# Altium schematic sheet MC_Sch_1.SchDoc
size A4
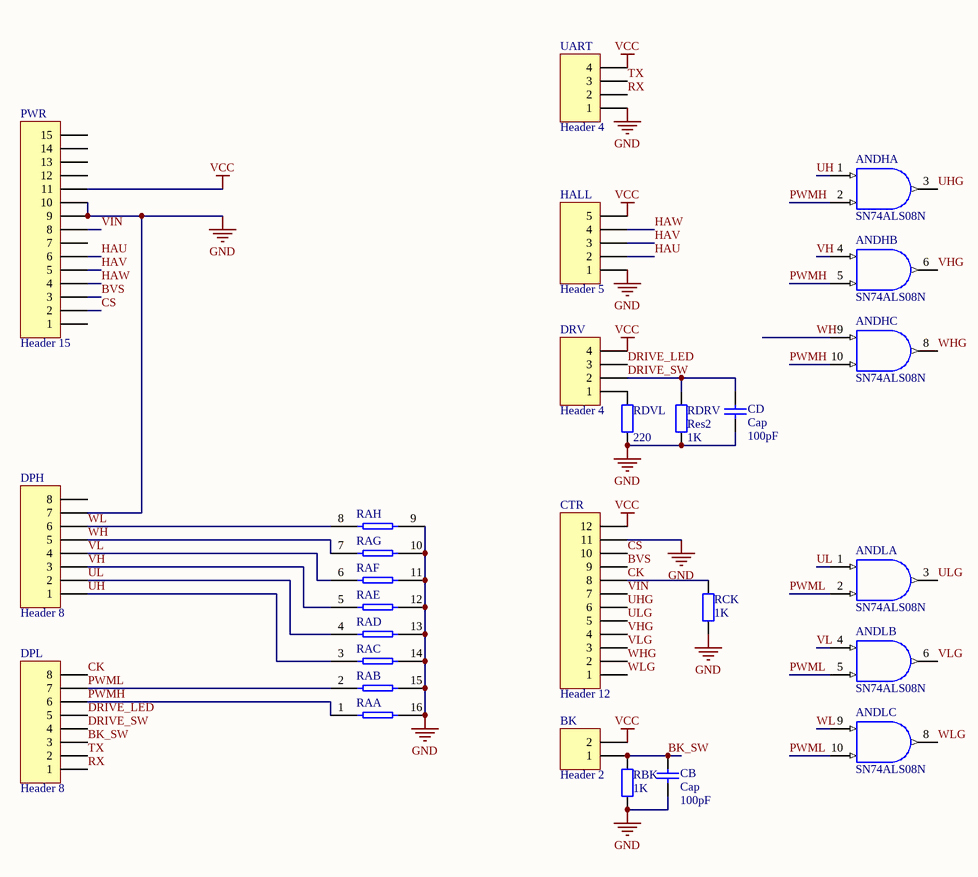
[diagram p0: MC_Sch_1.SchDoc]

## Parts
ANDH  SN74ALS08N  [N014]  (parts A,B,C of 4)
ANDL  SN74ALS08N  [N014]  (parts A,B,C of 4)
BK  Header 2  [HDR1X2]
CB  Cap  value 100pF  [CBB 6.3*6.3*5]
CD  Cap  value 100pF  [CBB 6.3*6.3*5]
CTR  Header 12  [HDR1X12]
DPH  Header 8  [HDR1X8]
DPL  Header 8  [HDR1X8]
DRV  Header 4  [HDR1X4]
HALL  Header 5  [HDR1X5]
PWR  Header 15  [HDR1X15]
RA  Res Pack2  [DIP-16]  (value not drawn)  (parts A,B,C,D,E,F,G,H of 8)
RBK  value 1K  [AXIAL-0.4]  (hidden comment: Res2)
RCK  value 1K  [AXIAL-0.4]  (hidden comment: Res2)
RDRV  Res2  value 1K  [AXIAL-0.4]
RDVL  value 220  [AXIAL-0.4]  (hidden comment: Res2)
UART  Header 4  [HDR1X4]

## Nets
GND: ANDH.7(GND) ANDL.7(GND) CB.1 CD.1 CTR.11 DPH.7 HALL.1 PWR.9 PWR.10 RA.9 RA.10 RA.11 RA.12 RA.13 RA.14 RA.15 RA.16 RBK.1 RCK.1 RDRV.1 RDVL.1 UART.1
VCC: ANDH.14(VCC) ANDL.14(VCC) BK.2 CTR.12 DRV.4 HALL.5 PWR.11 UART.4
BK_SW: BK.1 CB.2 DPL.3 RBK.2
BVS: CTR.9 PWR.3
CK: CTR.8 DPL.8 RCK.2
CS: CTR.10 PWR.2
DRIVE_LED: DPL.5 DRV.3
DRIVE_SW: CD.2 DPL.4 DRV.2 RDRV.2
HAU: HALL.2 PWR.6
HAV: HALL.3 PWR.5
HAW: HALL.4 PWR.4
PWMH: ANDH.2(B) ANDH.5(B) ANDH.10(B) DPL.6 RA.1
PWML: ANDL.2(B) ANDL.5(B) ANDL.10(B) DPL.7 RA.2
RX: DPL.1 UART.2
TX: DPL.2 UART.3
UH: ANDH.1(A) DPH.1 RA.3
UHG: ANDH.3(Y) CTR.6
UL: ANDL.1(A) DPH.2 RA.4
ULG: ANDL.3(Y) CTR.5
VH: ANDH.4(A) DPH.3 RA.5
VHG: ANDH.6(Y) CTR.4
VIN: CTR.7 PWR.8
VL: ANDL.4(A) DPH.4 RA.6
VLG: ANDL.6(Y) CTR.3
WH: ANDH.9(A) DPH.5 RA.7
WHG: ANDH.8(Y) CTR.2
WL: ANDL.9(A) DPH.6 RA.8
WLG: ANDL.8(Y) CTR.1
NetDRV_1: DRV.1 RDVL.2

Not connected (* = marked no-connect by the designer): DPH 8; PWR 1 7 12 13 14 15

## Library data of the parts
ANDH ANDL = SN74ALS08N: Quadruple 2-Input Positive-AND Gate; Published: 8-Jun-2000; LatestRevisionDate: 04-Mar-2005; LatestRevisionNote: Stylized 3D Model Added.; DatasheetVersion: Dec-1994; PackageVersion: Oct-1995; PackageReference: N014; Publisher: Altium Limited; PackageDescription: DIP; 14 Leads; Row Spacing 7.62 mm; Pitch 2.54 mm; ComponentLink1Description: Manufacturer Link; ComponentLink1URL: http://www.ti.com/; ComponentLink2Description: Datasheet; ComponentLink2URL: http://www-s.ti.com/sc/ds/sn74als08.pdf; ComponentLink3Description: Packaging Specification; ComponentLink3URL: http://focus.ti.com/lit/ml/mpdi002c/mpdi002c.pdf
BK = Header 2: Header, 2-Pin; LatestRevisionDate: 17-Jul-2002; LatestRevisionNote: Re-released for DXP Platform.; Publisher: Altium Limited
CB CD = Cap: Capacitor; Published: 8-Jun-2000; LatestRevisionDate: 17-Jul-2002; LatestRevisionNote: Re-released for DXP Platform.; PackageReference: RAD-0.3; Publisher: Altium Limited; PackageDescription: Radial Cap, Thru-Hole; 2 Leads; 0.3 in Pin Spacing
CTR = Header 12: Header, 12-Pin; LatestRevisionDate: 17-Jul-2002; LatestRevisionNote: Re-released for DXP Platform.; Publisher: Altium Limited
DPH DPL = Header 8: Header, 8-Pin; LatestRevisionDate: 17-Jul-2002; LatestRevisionNote: Re-released for DXP Platform.; Publisher: Altium Limited
DRV UART = Header 4: Header, 4-Pin; LatestRevisionDate: 17-Jul-2002; LatestRevisionNote: Re-released for DXP Platform.; Publisher: Altium Limited
HALL = Header 5: Header, 5-Pin; LatestRevisionDate: 17-Jul-2002; LatestRevisionNote: Re-released for DXP Platform.; Publisher: Altium Limited
PWR = Header 15: Header, 15-Pin; LatestRevisionDate: 17-Jul-2002; LatestRevisionNote: Re-released for DXP Platform.; Publisher: Altium Limited
RA = Res Pack2: Isolated Resistor Network - Parts; Sim Note: Enter the Resistance value into parameter field.; Value: 1K; Published: 24-Mar-1999; LatestRevisionDate: 17-Jul-2002; LatestRevisionNote: Re-released for DXP Platform.; PackageReference: DIP-16; Publisher: Altium Limited; Code_JEDEC: MO-001-AC
RBK RCK RDRV RDVL = Res2: Resistor; Published: 8-Jun-2000; LatestRevisionDate: 17-Jul-2002; LatestRevisionNote: Re-released for DXP Platform.; PackageReference: AXIAL-0.4; Publisher: Altium Limited; PackageDescription: Axial Device, Thru-Hole; 2 Leads; 0.4 in Pin Spacing